# EAGLE design baxandall (EAGLE 7.5.0)
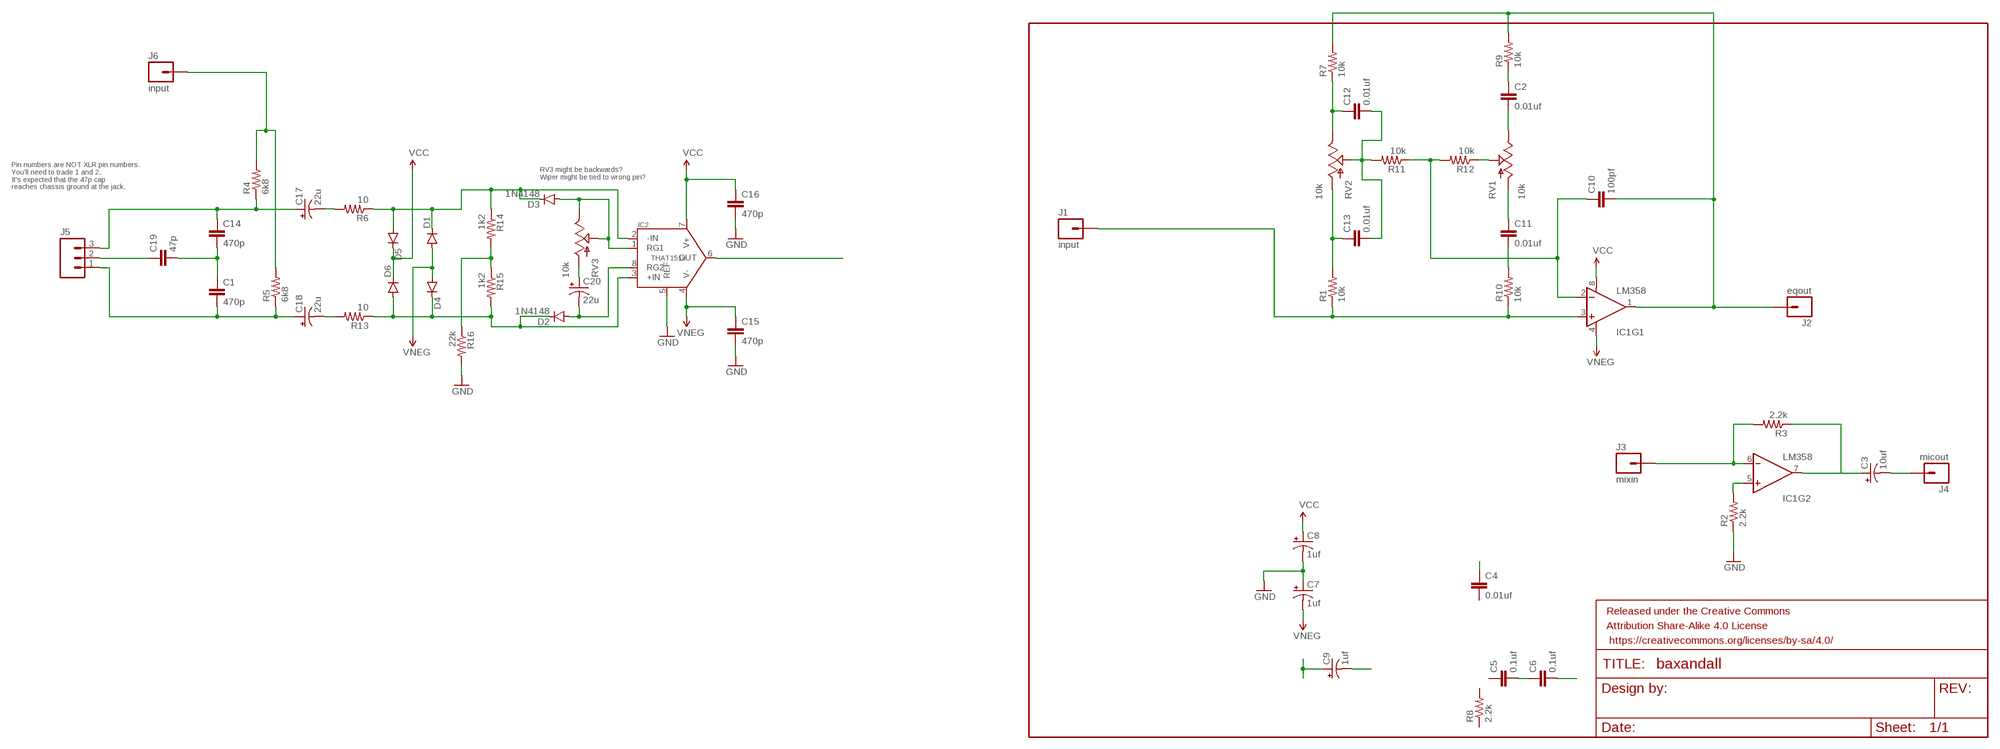
[diagram p0: schematic, sheet 1]

## Parts
C1  470p  CAPPTH  [CAP-PTH-SMALL]
C2  0.01uf  CAPPTH  [CAP-PTH-SMALL]
C3  10uf  10UF-25V-20%(PTH)  [CPOL-RADIAL-10UF-25V]
C4  0.01uf  CAPPTH  [CAP-PTH-SMALL]
C5  0.1uf  CAPPTH  [CAP-PTH-SMALL]
C6  0.1uf  CAPPTH  [CAP-PTH-SMALL]
C7  1uf  CAP_POLPTH2  [CPOL-RADIAL-10UF-25V]
C8  1uf  CAP_POLPTH2  [CPOL-RADIAL-10UF-25V]
C9  1uf  CAP_POLPTH2  [CPOL-RADIAL-10UF-25V]
C10  100pf  CAPPTH  [CAP-PTH-SMALL]
C11  0.01uf  CAPPTH  [CAP-PTH-SMALL]
C12  0.01uf  CAPPTH  [CAP-PTH-SMALL]
C13  0.01uf  CAPPTH  [CAP-PTH-SMALL]
C14  470p  CAPPTH  [CAP-PTH-SMALL]
C15  470p  CAPPTH  [CAP-PTH-SMALL]
C16  470p  CAPPTH  [CAP-PTH-SMALL]
C17  22u  100UF-25V-20%(PTH)  [CPOL-RADIAL-100UF-25V]
C18  22u  100UF-25V-20%(PTH)  [CPOL-RADIAL-100UF-25V]
C19  47p  CAPPTH  [CAP-PTH-SMALL]
C20  22u  100UF-25V-20%(PTH)  [CPOL-RADIAL-100UF-25V]
D1  DIODEKIT2  [DIODE-1N4001-KIT]
D2  1N4148  DIODE1N4148  [DIODE-1N4148]
D3  1N4148  DIODE1N4148  [DIODE-1N4148]
D4  DIODEKIT2  [DIODE-1N4001-KIT]
D5  DIODEKIT2  [DIODE-1N4001-KIT]
D6  DIODEKIT2  [DIODE-1N4001-KIT]
FRAME1  FRAME-LETTER  [CREATIVE_COMMONS]
IC1  LM358  [DIP08]
IC2  THAT151x  THAT151X  [DIP08-KIT]
J1  input  M01NOSILK-KIT  [1X01NS-KIT]
J2  eqout  M01NOSILK-KIT  [1X01NS-KIT]
J3  mixin  M01NOSILK-KIT  [1X01NS-KIT]
J4  micout  M01NOSILK-KIT  [1X01NS-KIT]
J5  M031X03_NO_SILK  [1X03_NO_SILK]
J6  input  M01NOSILK-KIT  [1X01NS-KIT]
R1  10k  10KOHM-1/4W-1%(PTH)HORIZ  [AXIAL-0.3]
R2  2.2k  RESISTORAXIAL-0.3  [AXIAL-0.3]
R3  2.2k  RESISTORAXIAL-0.3  [AXIAL-0.3]
R4  6k8  10KOHM-1/4W-1%(PTH)HORIZ  [AXIAL-0.3]
R5  6k8  10KOHM-1/4W-1%(PTH)HORIZ  [AXIAL-0.3]
R6  10  10KOHM-1/4W-1%(PTH)HORIZ  [AXIAL-0.3]
R7  10k  10KOHM-1/4W-1%(PTH)HORIZ  [AXIAL-0.3]
R8  2.2k  RESISTORAXIAL-0.3  [AXIAL-0.3]
R9  10k  10KOHM-1/4W-1%(PTH)HORIZ  [AXIAL-0.3]
R10  10k  10KOHM-1/4W-1%(PTH)HORIZ  [AXIAL-0.3]
R11  10k  10KOHM-1/4W-1%(PTH)HORIZ  [AXIAL-0.3]
R12  10k  10KOHM-1/4W-1%(PTH)HORIZ  [AXIAL-0.3]
R13  10  10KOHM-1/4W-1%(PTH)HORIZ  [AXIAL-0.3]
R14  1k2  10KOHM-1/4W-1%(PTH)HORIZ  [AXIAL-0.3]
R15  1k2  10KOHM-1/4W-1%(PTH)HORIZ  [AXIAL-0.3]
R16  22k  10KOHM-1/4W-1%(PTH)HORIZ  [AXIAL-0.3]
RV1  10k  POT-RV16AF-20  [POT_ALPHA_RV16AF-20]
RV2  10k  POT-RV16AF-20  [POT_ALPHA_RV16AF-20]
RV3  10k  POT-RV16AF-20  [POT_ALPHA_RV16AF-20]

## Nets
GND: C7.1(+) C8.2(-) C15.2 C16.2 IC2.5(REF) R2.P$1 R16.P$2
N$1: C12.1 R7.P$1 RV2.3(E)
N$2: C13.1 R1.P$2 RV2.1(A)
N$3: C10.1 IC1.2(-IN) R11.P$1 R12.P$2
N$4: C11.2 R10.P$2
N$5: C10.2 IC1.1(OUT) J2.1 R7.P$2 R9.P$2
N$6: IC1.5(+IN) R2.P$2
N$7: C3.1(+) IC1.7(OUT) R3.P$1
N$8: R12.P$1 RV1.2(S)
N$9: IC1.3(+IN) J1.1 R1.P$1 R10.P$1
N$10: C11.1 RV1.1(A)
N$11: IC1.6(-IN) J3.1 R3.P$2
N$12: C3.2(-) J4.1
N$13: C9.1(+)
N$14: C12.2 C13.2 R11.P$2 RV2.2(S)
N$15: C2.2 RV1.3(E)
N$16: C9.2(-)
N$17: C4.1
N$18: C5.2 C6.1
N$19: C2.1 R9.P$1
N$20: C6.2
N$21: C20.2(-) D2.A IC2.8(RG2)
N$22: IC2.6(OUT)
N$23: C19.1 J5.2
N$24: C1.1 C14.2 C19.2
N$25: C14.1 C17.1(+) J5.3 R4.P$1
N$26: C1.2 C18.1(+) J5.1 R5.P$1
N$27: C18.2(-) R13.P$2
N$28: J6.1 R4.P$2 R5.P$2
N$29: C17.2(-) R6.P$2
N$30: D1.C D3.C D5.A IC2.2(-IN) R6.P$1 R14.P$1
N$31: D2.C D4.C D6.A IC2.3(+IN) R13.P$1 R15.P$2
N$32: R14.P$2 R15.P$1 R16.P$1
N$33: D3.A IC2.1(RG1) RV3.2(S) RV3.3(E)
N$34: C20.1(+) RV3.1(A)
VCC: C8.1(+) C16.1 D5.C D6.C IC1.8(V+) IC2.7(V+)
VNEG: C7.2(-) C15.1 D1.A D4.A IC1.4(V-) IC2.4(V-)
Unconnected: C4.2 C5.1 R8.P$1 R8.P$2

## Notes on the sheet
- RV3 might be backwards? 
  Wiper might be tied to wrong pin?
- Pin numbers are NOT XLR pin numbers.
  You'll need to trade 1 and 2.
  It's expected that the 47p cap
  reaches chassis ground at the jack.

## Library data of the parts
C1 C2 C4-C6 C10-C16 C19 = SparkFun-Capacitors:CAP: Capacitor Standard 0603 ceramic capacitor, and 0.1" leaded capacitor.
C3 = SparkFun-Capacitors:10UF-25V-20%(PTH): CAP-08440; PROD_ID: CAP-08440
C7-C9 = SparkFun-Capacitors:CAP_POL: Capacitor Polarized These are standard SMD and PTH capacitors. Normally 10uF, 47uF, and 100uF in electrolytic and tantalum varieties. Always verify the external diameter of the through hole cap, it varies with capacity, voltage, and manufacturer. The EIA devices should be standard.
C17 C18 C20 = SparkFun-Capacitors:100UF-25V-20%(PTH): CAP-08439; PROD_ID: CAP-08439
D1 D4-D6 = SparkFun-DiscreteSemi:DIODE: Diode These are standard reverse protection diodes and small signal diodes. SMA package can handle up to about 1A. SOD-323 can handle about 200mA. What the SOD-323 package when ordering, there are some mfgs out there that are 5-pin packages.
D2 D3 = SparkFun-DiscreteSemi:DIODE: Diode These are standard reverse protection diodes and small signal diodes. SMA package can handle up to about 1A. SOD-323 can handle about 200mA. What the SOD-323 package when ordering, there are some mfgs out there that are 5-pin packages.; PROD_ID: DIO-08378
FRAME1 = SparkFun-Aesthetics:FRAME-LETTER: Schematic Frame Standard 8.5x11 US Letter frame
IC1 = SparkFun-AnalogIC:LM358: Jellybean op-amp; PROD_ID: IC-09172
IC2 = mosfet:THAT151X
J1-J4 J6 = SparkFun-Connectors:M01: Header 1 Standard 1-pin 0.1" header. Use with straight break away headers (SKU : PRT-00116), right angle break away headers (PRT-00553), swiss pins (PRT-00743), machine pins (PRT-00117), and female headers (PRT-00115). SMTSO-256-ET is a "flush mount" nut for a 4-40 screw. The older package used to be too tight, and did not allow it to sit properly thru the drill hit. The latest (0.165DIA) fits nice and snug.
J5 = SparkFun-Connectors:M03: Header 3 Standard 3-pin 0.1" header. Use with straight break away headers (SKU : PRT-00116), right angle break away headers (PRT-00553), swiss pins (PRT-00743), machine pins (PRT-00117), and female headers (PRT-00115). Molex polarized connector foot print use with SKU : PRT-08232 with associated crimp pins and housings.
R1 R7 R9-R12 = SparkFun-Resistors:10KOHM-1/4W-1%(PTH): RES-12183; PROD_ID: RES-12183
R2 R3 R8 = SparkFun-Resistors:RESISTOR: Resistor Basic schematic elements and footprints for 0603, 1206, and PTH resistors.
R4-R6 R13-R16 = SparkFun-Resistors:10KOHM-1/4W-1%(PTH): RES-12183; PROD_ID: RES-12183; VALUE: 10k
RV1-RV3 = SparkFun-Electromechanical:POT

## Board
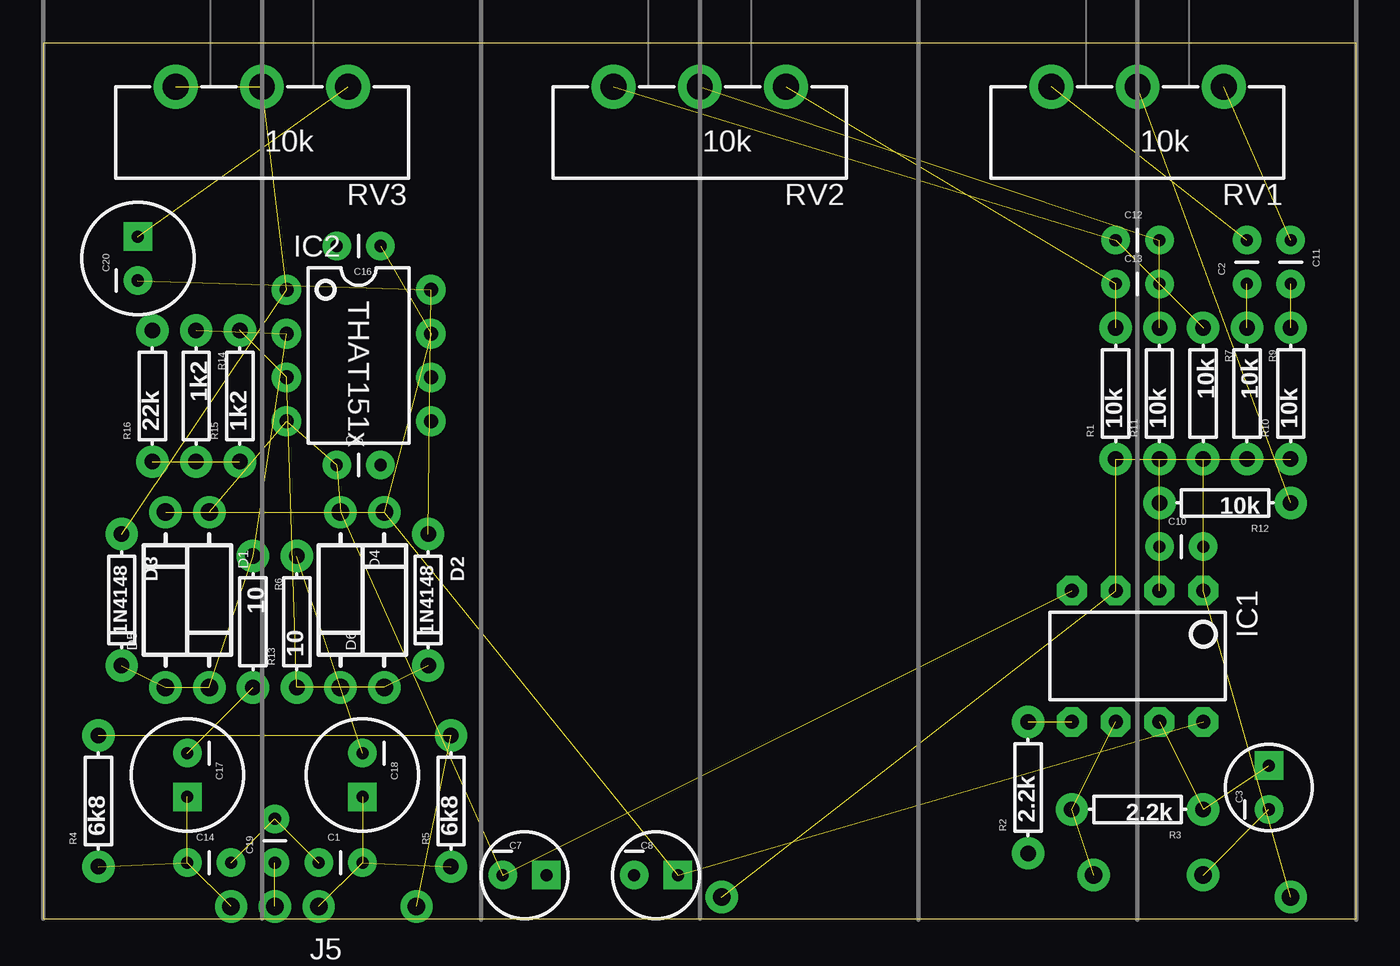
[diagram p1: board, top side]
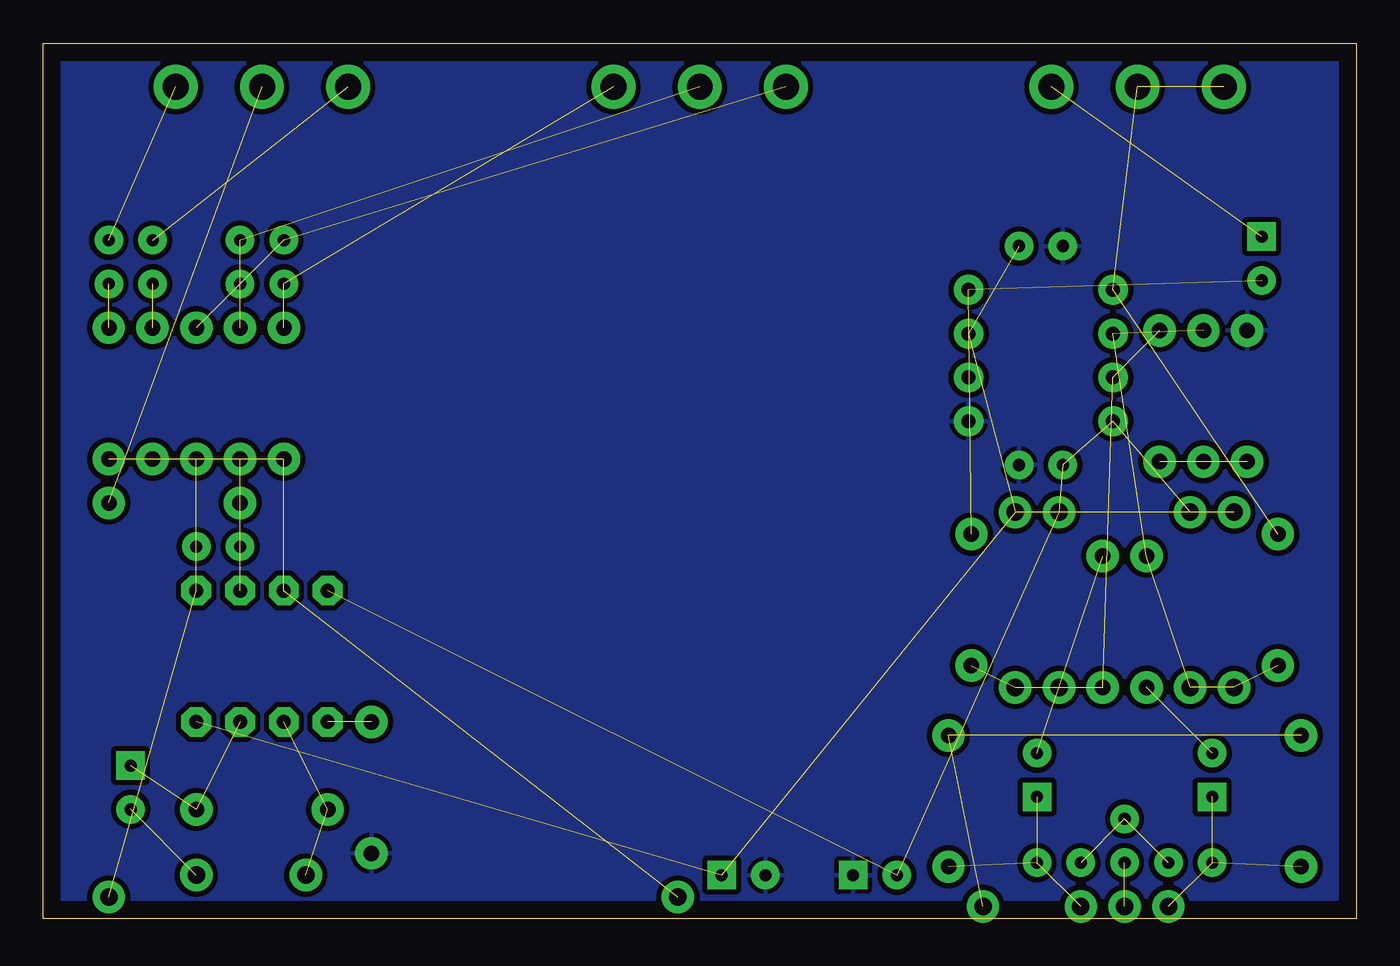
[diagram p2: board, bottom side, seen from below]

Size 76.2 x 50.8 mm. Coordinates in mm from the lower left corner, seen from the top.
Outline: 0,0 76.18,0 76.2,50.8 0,50.8 0,0
Copper layers (1*16): Top 0.035mm / dielectric 1.5mm / Bottom 0.035mm
Design rules "default": minimum track width 10mil, minimum drill 24mil, track to track 8mil, track to pad 8mil, pad to pad 8mil, via to via 8mil, smd to smd 8mil, copper to edge 40mil, drill to drill 8mil, minimum pad ring 10mil, minimum via ring 8mil, stop-mask expansion 4mil, vias tented up to drill 0mil, thermal gap 10mil

### Footprints (pad centres in the part's own frame; a part is rotated, then mirrored left to right if it is on the bottom)
CAP-PTH-SMALL = drill 0.7 pad 1.651: 1 0,0; 2 2.54,0
CPOL-RADIAL-10UF-25V = drill 0.7 pad 1.651 square: 1 1.27,0 | drill 0.7 pad 1.651: 2 -1.27,0
CPOL-RADIAL-100UF-25V = drill 0.7 pad 1.651 square: 1 1.27,0 | drill 0.7 pad 1.651: 2 -1.27,0
DIODE-1N4001-KIT = drill 1.016 pad 1.88: A -5.08,0; C 5.08,0
DIODE-1N4148 = drill 0.9 pad 1.88: A -3.81,0; C 3.81,0
DIP08 = drill 0.813 pad 1.727 octagon: 1 -3.81,-3.81; 2 -1.27,-3.81; 3 1.27,-3.81; 4 3.81,-3.81; 5 3.81,3.81; 6 1.27,3.81; 7 -1.27,3.81; 8 -3.81,3.81
DIP08-KIT = drill 0.813 pad 1.727: 1 -3.81,-4.191; 2 -1.27,-4.191; 3 1.27,-4.191; 4 3.81,-4.191; 5 3.81,4.191; 6 1.27,4.191; 7 -1.27,4.191; 8 -3.81,4.191
1X01NS-KIT = drill 1.016 pad 1.88: 1 0,0
1X03_NO_SILK = drill 1.016 pad 1.88: 1 0,0; 2 2.54,0; 3 5.08,0
AXIAL-0.3 = drill 0.9 pad 1.88: P$1 -3.81,0; P$2 3.81,0
POT_ALPHA_RV16AF-20 = drill 1.5 pad 2.54: 1 -5,0; 2 0,0; 3 5,0

### Placement (x,y rotation side)
C1  15.99,3.27 0 top
C2  69.85,36.83 90 top
C3  71.12,7.62 90 top
C4  86.36,17.78 0 top  (outside the outline)
C5  88.9,20.32 180 top  (outside the outline)
C6  88.9,22.86 180 top  (outside the outline)
C7  27.94,2.54 0 top
C8  35.56,2.54 0 top
C9  83.82,39.37 0 top  (outside the outline)
C10  64.77,21.59 0 top
C11  72.39,39.37 270 top
C12  62.23,39.37 0 top
C13  62.23,36.83 0 top
C14  8.37,3.27 0 top
C15  17.04,26.33 0 top
C16  19.58,39.03 180 top
C17  8.37,8.35 270 top
C18  18.53,8.35 270 top
C19  13.45,3.27 90 top
C20  5.5,38.3 90 top
D1  9.64,18.51 270 top
D2  22.34,18.51 270 top
D3  4.56,18.51 270 top
D4  17.26,18.51 270 top
D5  7.1,18.51 90 top
D6  19.8,18.51 90 top
FRAME1  13.97,-55.88 0 top  (outside the outline)
IC1  63.5,15.24 180 top
IC2  18.31,32.68 270 top
J1  39.37,1.27 0 top
J2  72.39,1.27 0 top
J3  60.96,2.54 0 top
J4  67.31,2.54 0 top
J5  15.99,0.73 180 top
J6  21.67,0.73 90 top
R1  62.23,30.48 90 top
R2  57.15,7.62 90 top
R3  63.5,6.35 180 top
R4  3.21,6.84 90 top
R5  23.67,6.84 90 top
R6  12.18,17.24 270 top
R7  67.31,30.48 270 top
R8  85.09,30.48 270 top  (outside the outline)
R9  69.85,30.48 270 top
R10  72.39,30.48 90 top
R11  64.77,30.48 90 top
R12  68.58,24.13 180 top
R13  14.72,17.24 90 top
R14  8.88,30.33 270 top
R15  11.42,30.33 90 top
R16  6.34,30.33 90 top
RV1  63.5,48.26 180 top
RV2  38.1,48.26 180 top
RV3  12.7,48.26 180 top

### Tracks (layer width: path | path; a pad name or v marks a point on that pad's centre or on a via)
GND
  pour Bottom (isolate 0.305): 0,0 0,50.8 76.2,50.8 76.2,0
N$1  (2 unrouted)
N$2  (2 unrouted)
N$3  (3 unrouted)
N$4  (1 unrouted)
N$5  (4 unrouted)
N$6  (1 unrouted)
N$7  (2 unrouted)
N$8  (1 unrouted)
N$9  (3 unrouted)
N$10  (1 unrouted)
N$11  (2 unrouted)
N$12  (1 unrouted)
N$14  (3 unrouted)
N$15  (1 unrouted)
N$18  (1 unrouted)
N$19  (1 unrouted)
N$21  (2 unrouted)
N$23  (1 unrouted)
N$24  (2 unrouted)
N$25  (3 unrouted)
N$26  (3 unrouted)
N$27  (1 unrouted)
N$28  (2 unrouted)
N$29  (1 unrouted)
N$30  (5 unrouted)
N$31  (5 unrouted)
N$32  (2 unrouted)
N$33  (3 unrouted)
N$34  (1 unrouted)
VCC  (5 unrouted)
VNEG  (5 unrouted)